# Altium schematic sheet cs301_Team_15.SchDoc
size A4; SheetNumber: 1; SheetTotal: 1
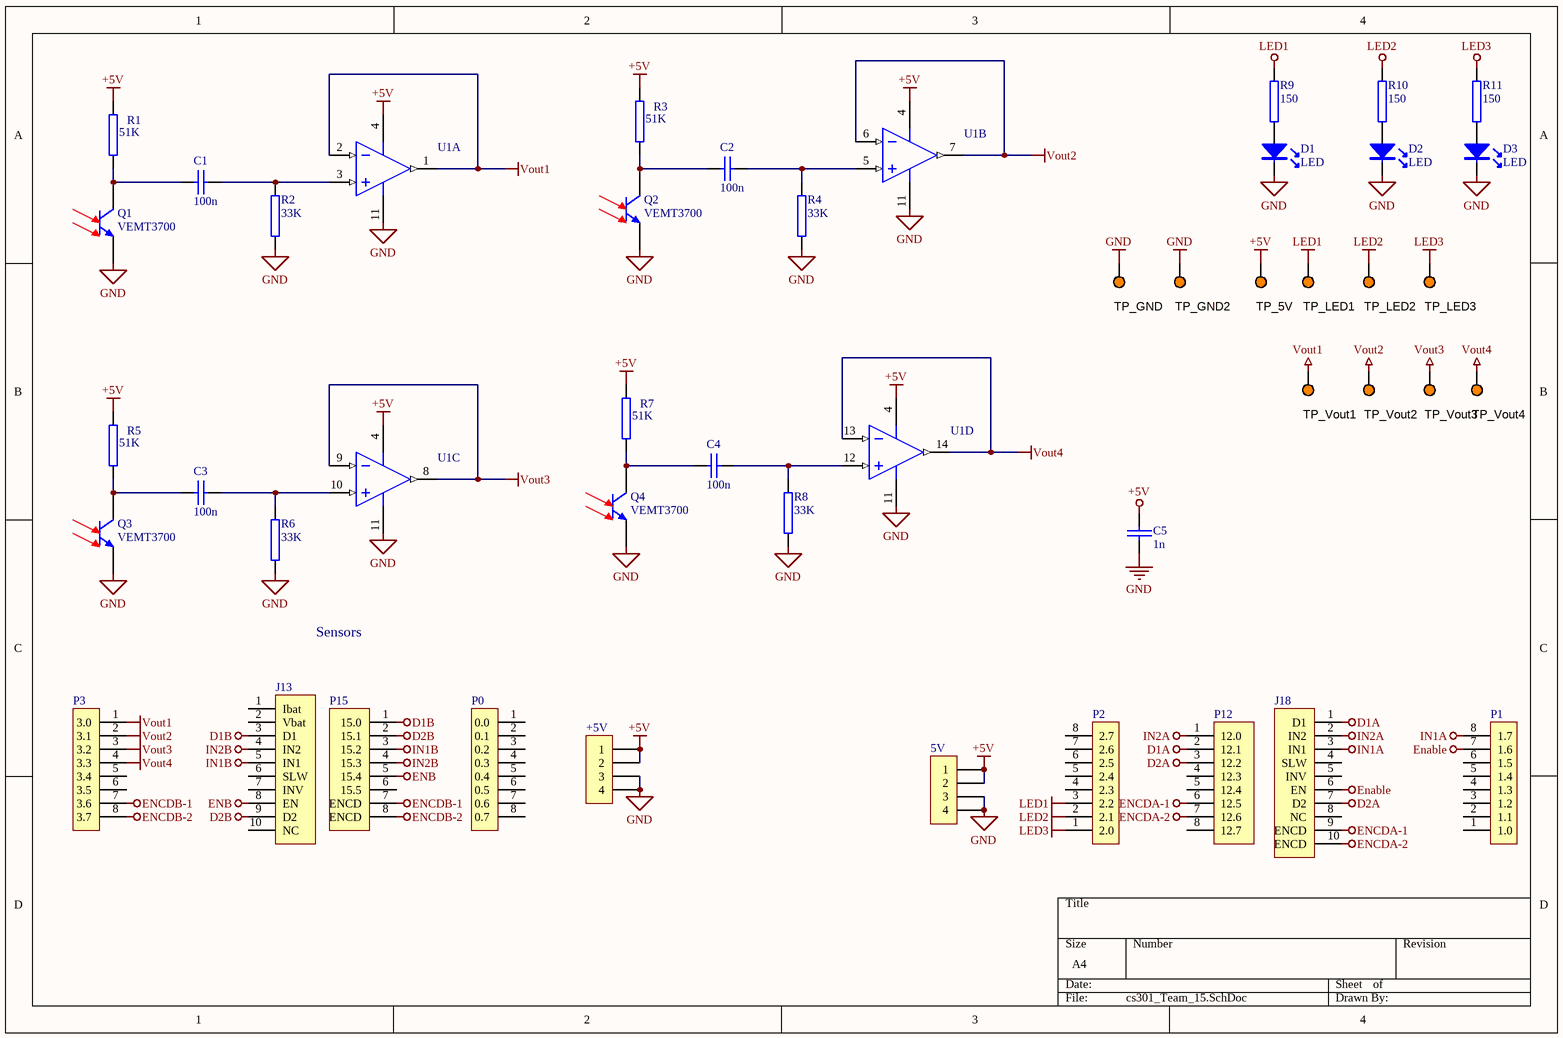
[diagram p0: cs301_Team_15.SchDoc]

## Parts
5V  5V  [IDC4]  (value not drawn)
+5V  5V  [IDC4]  (value not drawn)
C1  100n  [CCAP-5P0]
C2  100n  [CCAP-5P0]
C3  100n  [CCAP-5P0]
C4  100n  [CCAP-5P0]
C5  1n  [CCAP-5P0]
D1  LED  [LED0.1/5MM]
D2  LED  [LED0.1/5MM]
D3  LED  [LED0.1/5MM]
J13  CON10  [idc10]  (value not drawn)
J18  CON10  [IDC10]  (value not drawn)
P0  P0  [idc8]  (value not drawn)
P1  P1  [idc8]  (value not drawn)
P2  P2  [idc8]  (value not drawn)
P3  P3  [idc8]  (value not drawn)
P12  P12  [idc8]  (value not drawn)
P15  P15  [idc8]  (value not drawn)
Q1  VEMT3700  [VEMT3700]
Q2  VEMT3700  [VEMT3700]
Q3  VEMT3700  [VEMT3700]
Q4  VEMT3700  [VEMT3700]
R1  51K  [AXIAL0.4]
R2  33K  [AXIAL0.4]
R3  51K  [AXIAL0.4]
R4  33K  [AXIAL0.4]
R5  51K  [AXIAL0.4]
R6  33K  [AXIAL0.4]
R7  51K  [AXIAL0.4]
R8  33K  [AXIAL0.4]
R9  150  [AXIAL0.4]
R10  150  [AXIAL0.4]
R11  150  [AXIAL0.4]
TP_5V  5003  [TP_TH]  (value not drawn)
TP_GND  5003  [TP_TH]  (value not drawn)
TP_GND2  5003  [TP_TH]  (value not drawn)
TP_LED1  5003  [TP_TH]  (value not drawn)
TP_LED2  5003  [TP_TH]  (value not drawn)
TP_LED3  5003  [TP_TH]  (value not drawn)
TP_Vout1  5003  [TP_TH]  (value not drawn)
TP_Vout2  5003  [TP_TH]  (value not drawn)
TP_Vout3  5003  [TP_TH]  (value not drawn)
TP_Vout4  5003  [TP_TH]  (value not drawn)
U1  LM324  [DIP-14]  (value not drawn)  (parts A,B,C,D of 4)

## Nets
+5V: 5V.1 5V.2 +5V.1 +5V.2 C5.1 R1.2 R3.2 R5.2 R7.2 TP_5V.1 U1.4(VDD)
D1A: J18.1(D1) P12.2(12.1)
D1B: J13.3(D1) P15.1(15.0)
D2A: J18.7(D2) P12.3(12.2)
D2B: J13.9(D2) P15.2(15.1)
Enable: J18.6(EN) P1.7(1.6)
ENB: J13.8(EN) P15.5(15.4)
ENCDA-1: J18.9(ENCD) P12.6(12.5)
ENCDA-2: J18.10(ENCD) P12.7(12.6)
ENCDB-1: P3.7(3.6) P15.7(ENCD)
ENCDB-2: P3.8(3.7) P15.8(ENCD)
GND: 5V.3 5V.4 +5V.3 +5V.4 C5.2 D1.K D2.K D3.K Q1.2(E) Q2.2(E) Q3.2(E) Q4.2(E) R2.1 R4.1 R6.1 R8.1 TP_GND.1 TP_GND2.1 U1.11(VSS)
IN1A: J18.3(IN1) P1.8(1.7)
IN1B: J13.5(IN1) P15.3(15.2)
IN2A: J18.2(IN2) P12.1(12.0)
IN2B: J13.4(IN2) P15.4(15.3)
LED1: P2.3(2.2) R9.2 TP_LED1.1
LED2: P2.2(2.1) R10.2 TP_LED2.1
LED3: P2.1(2.0) R11.1 TP_LED3.1
Vout1: P3.1(3.0) TP_Vout1.1 U1.1(VOUTA) U1.2(VINA-)
Vout2: P3.2(3.1) TP_Vout2.1 U1.6(VINB-) U1.7(VOUTB)
Vout3: P3.3(3.2) TP_Vout3.1 U1.8(VOUTC) U1.9(VINC-)
Vout4: P3.4(3.3) TP_Vout4.1 U1.13(VIND-) U1.14(VOUTD)
NetC1_1: C1.1 Q1.1(C) R1.1
NetC1_2: C1.2 R2.2 U1.3(VINA+)
NetC2_1: C2.1 Q2.1(C) R3.1
NetC2_2: C2.2 R4.2 U1.5(VINB+)
NetC3_1: C3.1 Q3.1(C) R5.1
NetC3_2: C3.2 R6.2 U1.10(VINC+)
NetC4_1: C4.1 Q4.1(C) R7.1
NetC4_2: C4.2 R8.2 U1.12(VIND+)
NetD1_A: D1.A R9.1
NetD2_A: D2.A R10.1
NetD3_A: D3.A R11.2

Not connected (* = marked no-connect by the designer): J13 1(Ibat) 2(Vbat) 6(SLW) 7(INV) 10(NC); J18 4(SLW) 5(INV) 8(NC); P0 1(0.0) 2(0.1) 3(0.2) 4(0.3) 5(0.4) 6(0.5) 7(0.6) 8(0.7); P1 1(1.0) 2(1.1) 3(1.2) 4(1.3) 5(1.4) 6(1.5); P2 4(2.3) 5(2.4) 6(2.5) 7(2.6) 8(2.7); P3 5(3.4) 6(3.5); P12 4(12.3) 5(12.4) 8(12.7); P15 6(15.5)

## Notes on the sheet
- Sensors

## Library data of the parts
5V +5V = CON4: Connector
C1-C5 = CerCap_TH_5P0: TH ceramic capacitor with 5mm pitch; Value: *
J13 J18 = CON10: Connector
P0-P3 = CON8: Connector
P12 P15 = CON8_1: Connector
Q1-Q4 = VEMT3700: Silicon NPN Phototransistor
R1-R11 = RES2
TP_5V TP_GND TP_GND2 TP_LED1-TP_LED3 TP_Vout1-TP_Vout4 = TestPoint: Test Point, Orange, 1-Pin THD, RoHS; Peak Reverse Current: 600 uA; Forward Current: 3 A; Max Surge Current: 80 A; Forward Voltage: 1.08 V; Max Operating Temperature: 150 degC; PackageReference: 5003; Pins: 2; ComponentLink2URL: http://keyelco.com/userAssets/file/M65p56.pdf; PackageDescription: 1-Pin Through Hole Device, Dia 2.54 mm; Weight: 0.01 lb; Diameter: 5.3 mm; Mount: Through Hole; Package Quantity: 500; Packaging: Bulk; Min Operating Temperature: -65 degC; ComponentLink1Description: Manufacturer URL; Height: 0.25 inch; ComponentLink1URL: http://www.keyelco.com/; ComponentLink2Description: Datasheet; Width: 0.25 inch; REACH SVHC: No SVHC; RoHSCompliant: true; Radiation Hardening: No; Length: 9.5 mm; DatasheetVersion: Jun-15
U1 = LM324N_TH_DIP16: IC OPAMP GP 14DIP; Manufacturer: ON Semiconductor; Manufacturer Part Number: LM324N; Amplifier Type: General Purpose; Current - Supply: 1mA; Voltage - Supply, Single/Dual (±): 3 V ~ 32 V, ±1.5 V ~ 16 V; Supplier 1: Digi-Key; RoHS: RoHS Compliant; Category: Integrated Circuits (ICs); Stock 1: 2900; Pricing 1: 1=0.9, 10=0.775, 100=0.5789, 500=0.45482, 1000=0.35145 (NZD); Packaging: Tube; Part Status: Active; Output Type: -; Slew Rate: -; Operating Temperature: 0°C ~ 70°C; Mounting Type: Through Hole; Package / Case: 14-DIP (0.300", 7.62mm); Supplier Device Package: 14-DIP; Base Part Number: LM324; ComponentLink1URL: https://www.fairchildsemi.com/datasheets/LM/LM2902.pdf; ComponentLink1Description: https://www.fairchildsemi.com/datasheets/LM/LM2902.pdf; Supplier Part Number 1: LM324NFS-ND